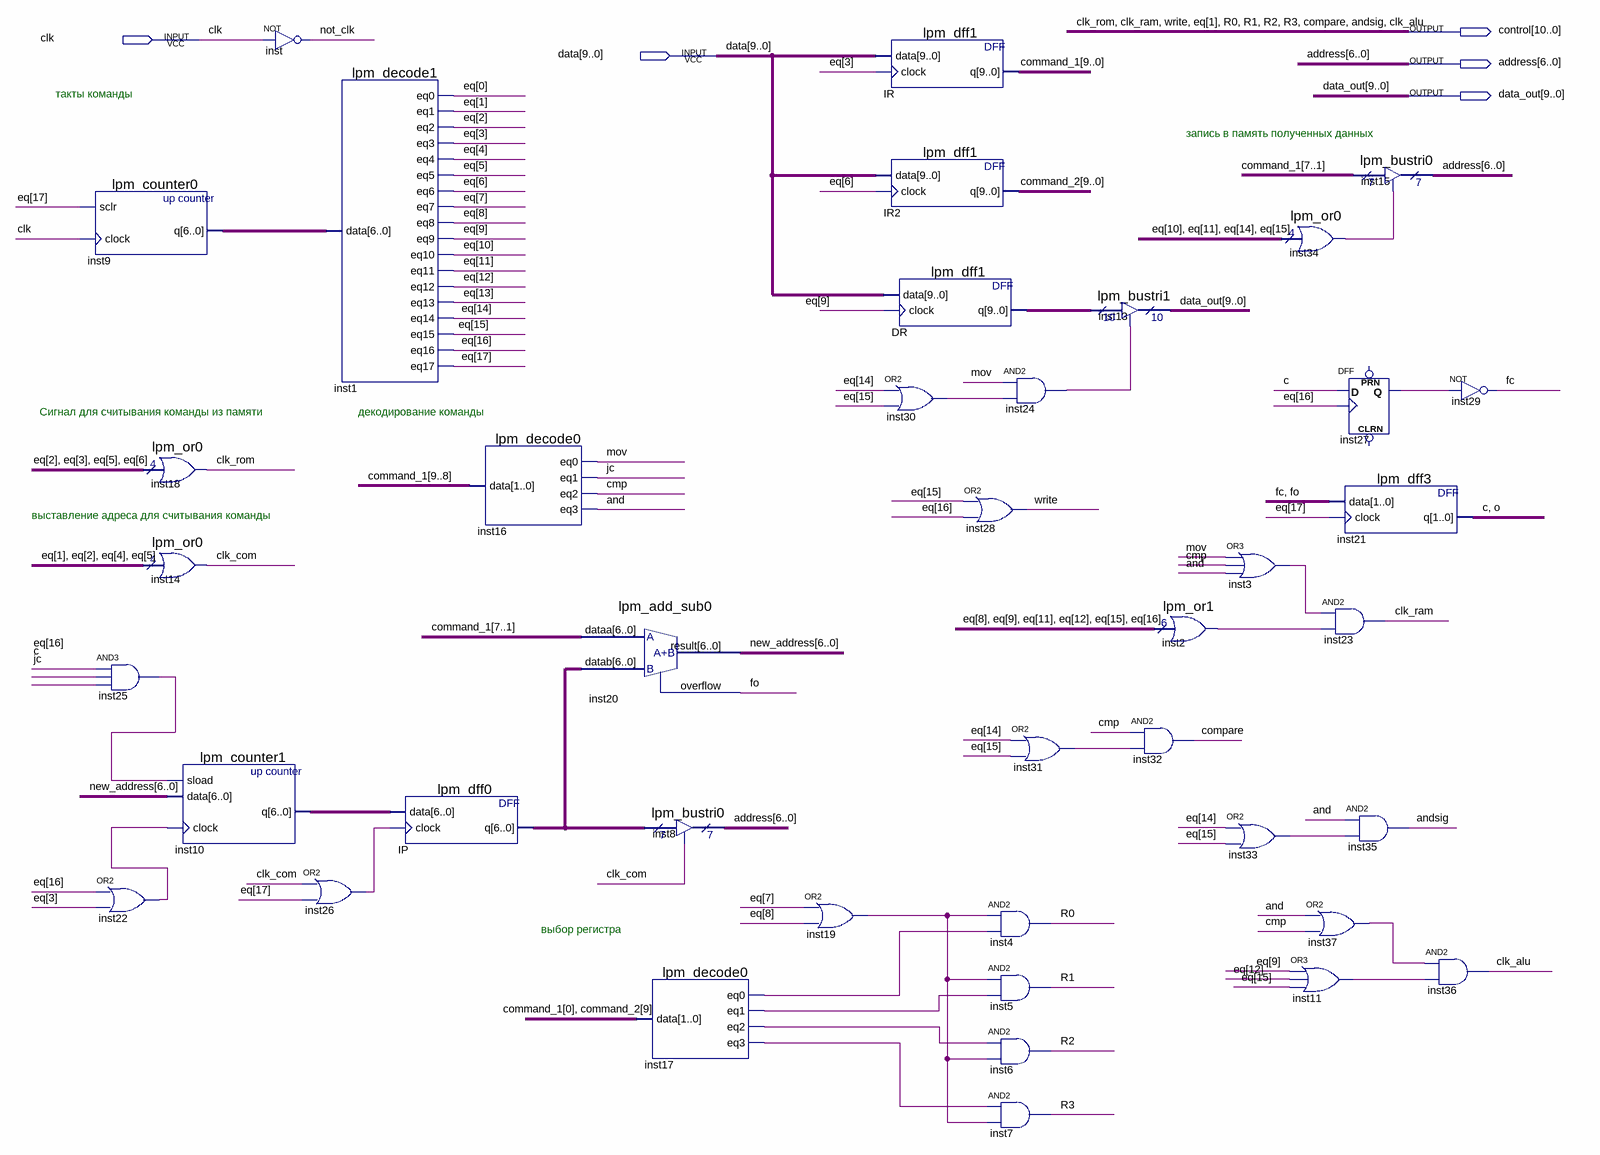
[diagram p0: schematic sheet]
// Quartus schematic control.bdf as structural Verilog: 41 symbols, 5 pins
module control (
  input  clk,
  input  [9:0] data,
  output [10:0] control,
  output [6:0] address,
  output [9:0] data_out
);

  wire \and , c, clk_com, cmp, fc, fo, inst2_result, inst3_out, inst11_out, inst17_eq0, inst17_eq1,
       inst17_eq2, inst17_eq3, inst19_out, inst22_out, inst24_out, inst25_out, inst26_out, inst27_q,
       inst30_out, inst31_out, inst33_out, inst34_result, inst37_out, jc, mov, not_clk, o;
  wire [6:0] inst9_q, inst10_q, IP_q, new_address;
  wire [9:0] command_1, command_2, DR_q;
  wire [17:0] eq;

  lpm_counter0 inst9 (.sclr(eq[17]), .clock(clk), .q(inst9_q));
  lpm_or0 inst18 (.data({eq[2], eq[3], eq[5], eq[6]}), .result(control[10]));
  lpm_or0 inst14 (.data({control[7], eq[2], eq[4], eq[5]}), .result(clk_com));
  and inst25 (inst25_out, eq[16], c, jc);
  or inst22 (inst22_out, eq[16], eq[3]);
  lpm_counter1 inst10 (.sload(inst25_out), .data(new_address), .clock(inst22_out), .q(inst10_q));
  not inst (not_clk, clk);
  lpm_decode1 inst1 (
    .data(inst9_q), .eq0(eq[0]), .eq1(control[7]), .eq2(eq[2]), .eq3(eq[3]), .eq4(eq[4]), .eq5(eq[5]),
    .eq6(eq[6]), .eq7(eq[7]), .eq8(eq[8]), .eq9(eq[9]), .eq10(eq[10]), .eq11(eq[11]), .eq12(eq[12]),
    .eq13(eq[13]), .eq14(eq[14]), .eq15(eq[15]), .eq16(eq[16]), .eq17(eq[17]));
  or inst26 (inst26_out, clk_com, eq[17]);
  lpm_dff0 IP (.data(inst10_q), .clock(inst26_out), .q(IP_q));
  lpm_decode0 inst16 (.data(command_1[9:8]), .eq0(mov), .eq1(jc), .eq2(cmp), .eq3(\and ));
  lpm_add_sub0 inst20 (.dataa(command_1[7:1]), .datab(IP_q), .result(new_address), .overflow(fo));
  lpm_bustri0 inst8 (.enabledt(clk_com), .data(IP_q), .tridata(address));
  lpm_decode0 inst17 (
    .data({command_1[0], command_2[9]}), .eq0(inst17_eq0), .eq1(inst17_eq1), .eq2(inst17_eq2),
    .eq3(inst17_eq3));
  or inst19 (inst19_out, eq[7], eq[8]);
  lpm_dff1 IR (.data(data), .clock(eq[3]), .q(command_1));
  lpm_dff1 IR2 (.data(data), .clock(eq[6]), .q(command_2));
  lpm_dff1 DR (.data(data), .clock(eq[9]), .q(DR_q));
  or inst30 (inst30_out, eq[14], eq[15]);
  or inst28 (control[8], eq[15], eq[16]);
  and inst24 (inst24_out, mov, inst30_out);
  or inst31 (inst31_out, eq[14], eq[15]);
  and inst4 (control[6], inst19_out, inst17_eq0);
  and inst5 (control[5], inst19_out, inst17_eq1);
  and inst6 (control[4], inst17_eq2, inst19_out);
  and inst7 (control[3], inst17_eq3, inst19_out);
  lpm_bustri1 inst13 (.enabledt(inst24_out), .data(DR_q), .tridata(data_out));
  lpm_or1 inst2 (.data({eq[8], eq[9], eq[11], eq[12], eq[15], eq[16]}), .result(inst2_result));
  and inst32 (control[2], cmp, inst31_out);
  or inst3 (inst3_out, mov, cmp, \and );
  or inst33 (inst33_out, eq[14], eq[15]);
  lpm_or0 inst34 (.data({eq[10], eq[11], eq[14], eq[15]}), .result(inst34_result));
  or inst11 (inst11_out, eq[9], eq[12], eq[15]);
  lpm_bustri0 inst15 (.enabledt(inst34_result), .data(command_1[7:1]), .tridata(address));
  DFF inst27 (.CLK(eq[16]), .D(c), .Q(inst27_q));  // open: CLRN, PRN
  lpm_dff3 inst21 (.data({fc, fo}), .clock(eq[17]), .q({c, o}));
  and inst23 (control[9], inst3_out, inst2_result);
  and inst35 (control[1], \and , inst33_out);
  or inst37 (inst37_out, \and , cmp);
  and inst36 (control[0], inst37_out, inst11_out);
  not inst29 (fc, inst27_q);

  // Other names for the same wires on the sheet: andsig = control[1]; clk_alu = control[0]; clk_ram = control[9];
  //   clk_rom = control[10]; compare = control[2]; eq[1] = control[7]; R0 = control[6]; R1 = control[5];
  //   R2 = control[4]; R3 = control[3]; write = control[8]

  // Notes on the sheet:
  //   такты команды
  //   запись в память полученных данных
  //   Сигнал для считывания команды из памяти
  //   декодирование команды
  //   выставление адреса для считывания команды
  //   выбор регистра
endmodule
